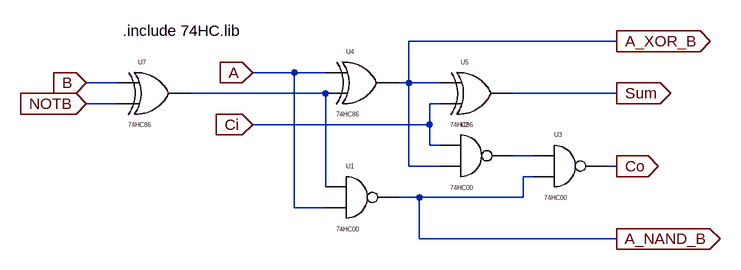
[diagram p0: schematic ALU1.asc]
ALU1.asc, the LTspice schematic file:
Version 4
SHEET 1 936 680
WIRE 768 32 448 32
WIRE 272 80 208 80
WIRE 320 80 272 80
WIRE 0 96 -48 96
WIRE 448 96 448 32
WIRE 448 96 432 96
WIRE 496 96 448 96
WIRE 320 112 112 112
WIRE 768 112 608 112
WIRE 0 128 -48 128
WIRE 496 128 480 128
WIRE 480 160 480 128
WIRE 480 160 208 160
WIRE 480 192 480 160
WIRE 496 192 480 192
WIRE 640 208 608 208
WIRE 448 224 448 96
WIRE 496 224 448 224
WIRE 768 224 752 224
WIRE 640 240 624 240
WIRE 320 256 320 112
WIRE 464 272 432 272
WIRE 624 272 624 240
WIRE 624 272 464 272
WIRE 272 288 272 80
WIRE 320 288 272 288
WIRE 464 336 464 272
WIRE 768 336 464 336
FLAG 208 80 A
IOPIN 208 80 In
FLAG 208 160 Ci
IOPIN 208 160 In
FLAG 768 112 Sum
IOPIN 768 112 Out
FLAG 768 224 Co
IOPIN 768 224 Out
FLAG -48 96 B
IOPIN -48 96 In
FLAG -48 128 NOTB
IOPIN -48 128 In
FLAG 768 336 A_NAND_B
IOPIN 768 336 Out
FLAG 768 32 A_XOR_B
IOPIN 768 32 Out
SYMBOL 74hc00 368 208 R0
SYMATTR InstName U1
SYMBOL 74hc00 544 144 R0
SYMATTR InstName U2
SYMBOL 74hc00 688 160 R0
SYMATTR InstName U3
SYMBOL 74hc86 368 32 R0
SYMATTR InstName U4
SYMBOL 74hc86 544 48 R0
SYMATTR InstName U5
SYMBOL 74hc86 48 48 R0
SYMATTR InstName U7
TEXT 8 16 Left 2 !.include 74HC.lib

The netlist it stands for:
* ALU1.asc
XU1 N001 A A_NAND_B VCC 0 74HC00 VCC=5  SPEED=1.0  TRIPDT=1e-9  ; pins A B Y
XU2 Ci A_XOR_B N002 VCC 0 74HC00 VCC=5  SPEED=1.0  TRIPDT=1e-9  ; pins A B Y
XU3 N002 A_NAND_B Co VCC 0 74HC00 VCC=5  SPEED=1.0  TRIPDT=1e-9  ; pins A B Y
XU4 A N001 A_XOR_B VCC 0 74HC86 VCC=5  SPEED=1.0  TRIPDT=1e-9  ; pins A B Y
XU5 A_XOR_B Ci Sum VCC 0 74HC86 VCC=5  SPEED=1.0  TRIPDT=1e-9  ; pins A B Y
XU7 B NOTB N001 VCC 0 74HC86 VCC=5  SPEED=1.0  TRIPDT=1e-9  ; pins A B Y
.include 74HC.lib
.backanno
.end